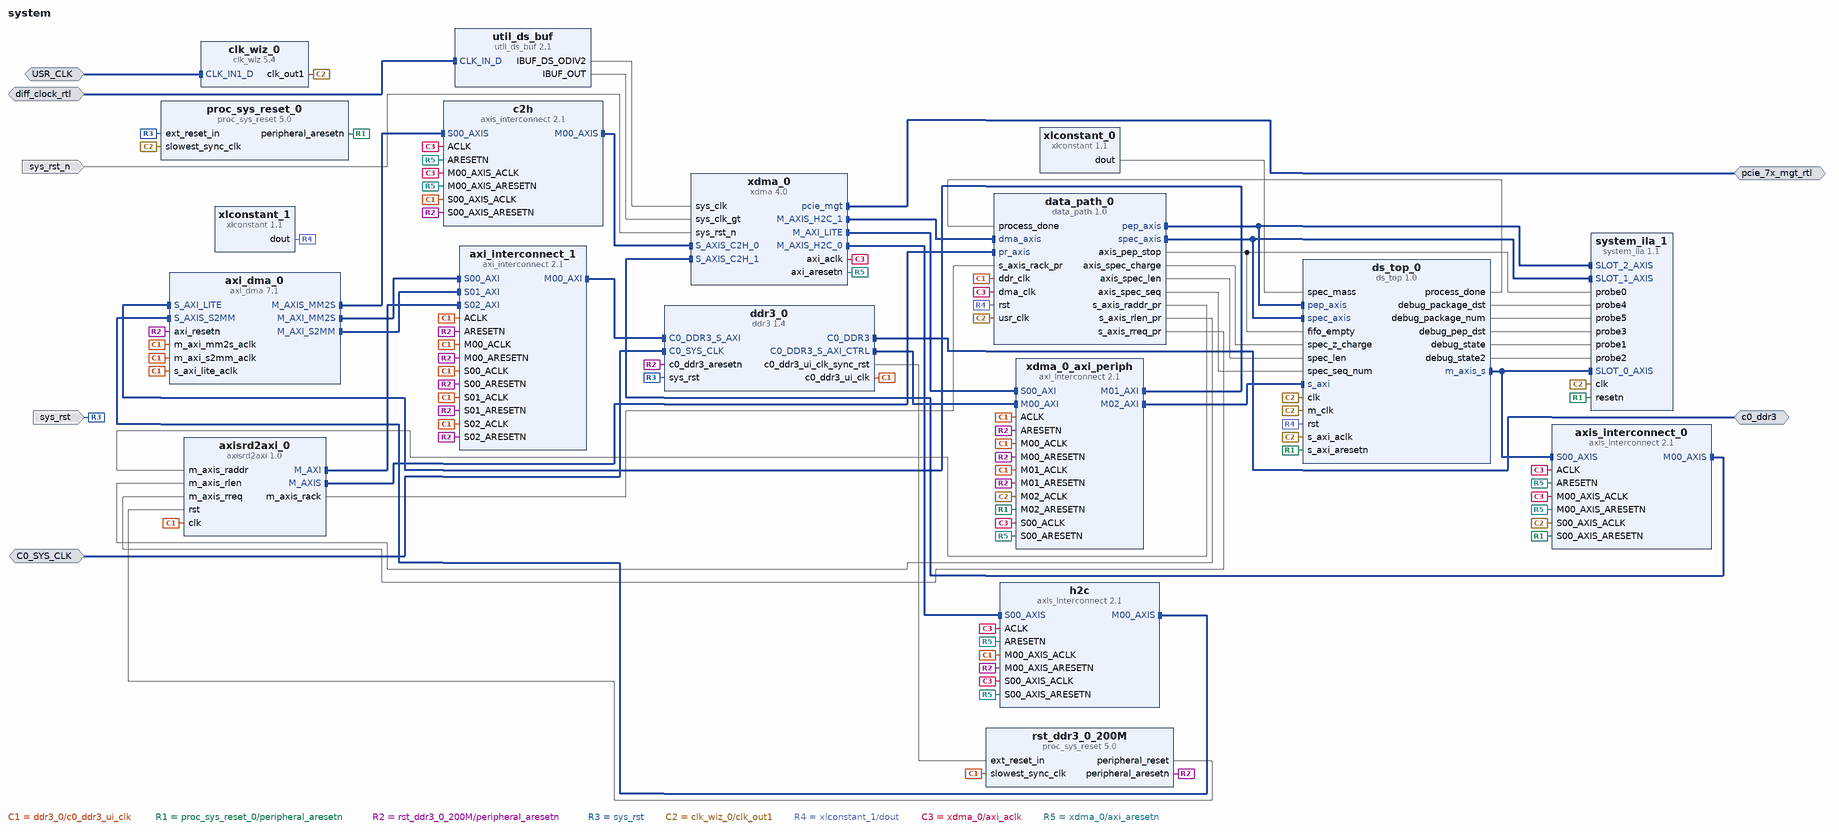
[diagram p0: block diagram of the top level]
# Vivado block design system, xcku115-flva1517-2-e, Vivado 2017.4
create_bd_design system

create_bd_intf_port -mode Slave -vlnv xilinx.com:interface:diff_clock_rtl:1.0 C0_SYS_CLK
set_property -dict {CONFIG.FREQ_HZ 400000000} [get_bd_intf_ports C0_SYS_CLK]
create_bd_intf_port -mode Slave -vlnv xilinx.com:interface:diff_clock_rtl:1.0 USR_CLK
create_bd_intf_port -mode Master -vlnv xilinx.com:interface:ddrx_rtl:1.0 c0_ddr3
create_bd_intf_port -mode Slave -vlnv xilinx.com:interface:diff_clock_rtl:1.0 diff_clock_rtl
set_property -dict {CONFIG.FREQ_HZ 100000000} [get_bd_intf_ports diff_clock_rtl]
create_bd_intf_port -mode Master -vlnv xilinx.com:interface:pcie_7x_mgt_rtl:1.0 pcie_7x_mgt_rtl
create_bd_port -dir I -type rst sys_rst
set_property -dict {CONFIG.POLARITY ACTIVE_HIGH} [get_bd_ports sys_rst]
create_bd_port -dir I -type rst sys_rst_n

create_bd_cell -type ip -vlnv xilinx.com:ip:axi_dma:7.1 axi_dma_0
set_property -dict {CONFIG.c_include_sg 0 CONFIG.c_sg_length_width 22} [get_bd_cells axi_dma_0]
create_bd_cell -type ip -vlnv xilinx.com:ip:axi_interconnect:2.1 axi_interconnect_1
set_property -dict {CONFIG.NUM_SI 3 CONFIG.NUM_MI 1 CONFIG.SYNCHRONIZATION_STAGES 2} [get_bd_cells axi_interconnect_1]
create_bd_cell -type ip -vlnv xilinx.com:ip:axis_interconnect:2.1 axis_interconnect_0
set_property -dict {CONFIG.NUM_MI 1} [get_bd_cells axis_interconnect_0]
create_bd_cell -type ip -vlnv xilinx.com:user:axisrd2axi:1.0 axisrd2axi_0
create_bd_cell -type ip -vlnv xilinx.com:ip:axis_interconnect:2.1 c2h
set_property -dict {CONFIG.NUM_MI 1} [get_bd_cells c2h]
create_bd_cell -type ip -vlnv xilinx.com:ip:clk_wiz:5.4 clk_wiz_0
set_property -dict [list \
  CONFIG.PRIMITIVE Auto \
  CONFIG.USE_FREQ_SYNTH false \
  CONFIG.USE_PHASE_ALIGNMENT false \
  CONFIG.SECONDARY_SOURCE Single_ended_clock_capable_pin \
  CONFIG.PRIM_SOURCE Differential_clock_capable_pin \
  CONFIG.CLKOUT1_DRIVES Buffer \
  CONFIG.CLKOUT2_DRIVES Buffer \
  CONFIG.CLKOUT3_DRIVES Buffer \
  CONFIG.CLKOUT4_DRIVES Buffer \
  CONFIG.CLKOUT5_DRIVES Buffer \
  CONFIG.CLKOUT6_DRIVES Buffer \
  CONFIG.CLKOUT7_DRIVES Buffer \
  CONFIG.FEEDBACK_SOURCE FDBK_AUTO \
  CONFIG.USE_LOCKED false \
  CONFIG.USE_RESET false \
  CONFIG.MMCM_DIVCLK_DIVIDE 1 \
  CONFIG.MMCM_CLKFBOUT_MULT_F 10.000 \
  CONFIG.MMCM_CLKIN1_PERIOD 10.000 \
  CONFIG.MMCM_CLKIN2_PERIOD 10.000 \
  CONFIG.MMCM_COMPENSATION AUTO \
  CONFIG.MMCM_CLKOUT0_DIVIDE_F 10.000 \
  CONFIG.AUTO_PRIMITIVE BUFGCE_DIV \
  CONFIG.CLKOUT1_JITTER 130.958 \
  CONFIG.CLKOUT1_PHASE_ERROR 98.575 \
] [get_bd_cells clk_wiz_0]
create_bd_cell -type ip -vlnv fudan:bio:data_path:1.0 data_path_0
create_bd_cell -type ip -vlnv xilinx.com:ip:ddr3:1.4 ddr3_0
set_property -dict [list \
  CONFIG.C0.DDR3_TimePeriod 1250 \
  CONFIG.C0.DDR3_InputClockPeriod 2500 \
  CONFIG.C0.DDR3_MemoryType SODIMMs \
  CONFIG.C0.DDR3_MemoryPart MT9KSF51272HZ-1G6 \
  CONFIG.C0.DDR3_DataWidth 72 \
  CONFIG.C0.DDR3_CasLatency 11 \
  CONFIG.C0.DDR3_CasWriteLatency 8 \
  CONFIG.C0.DDR3_AxiDataWidth 512 \
  CONFIG.C0.DDR3_AxiArbitrationScheme WRITE_PRIORITY_REG \
  CONFIG.C0.DDR3_AxiAddressWidth 32 \
  CONFIG.C0.DDR3_Mem_Add_Map BANK_ROW_COLUMN \
] [get_bd_cells ddr3_0]
create_bd_cell -type ip -vlnv fudan:bio:ds_top:1.0 ds_top_0
create_bd_cell -type ip -vlnv xilinx.com:ip:axis_interconnect:2.1 h2c
set_property -dict {CONFIG.NUM_MI 1} [get_bd_cells h2c]
create_bd_cell -type ip -vlnv xilinx.com:ip:proc_sys_reset:5.0 proc_sys_reset_0
create_bd_cell -type ip -vlnv xilinx.com:ip:proc_sys_reset:5.0 rst_ddr3_0_200M
create_bd_cell -type ip -vlnv xilinx.com:ip:system_ila:1.1 system_ila_1
set_property -dict [list \
  CONFIG.C_SLOT_1_TYPE 0 \
  CONFIG.C_SLOT_0_TYPE 0 \
  CONFIG.C_SLOT_0_APC_EN 0 \
  CONFIG.C_SLOT_1_APC_EN 0 \
  CONFIG.C_SLOT_2_APC_EN 0 \
  CONFIG.C_SLOT_0_AXI_DATA_SEL 1 \
  CONFIG.C_SLOT_1_AXI_DATA_SEL 1 \
  CONFIG.C_SLOT_2_AXI_DATA_SEL 1 \
  CONFIG.C_SLOT_0_AXI_TRIG_SEL 1 \
  CONFIG.C_SLOT_1_AXI_TRIG_SEL 1 \
  CONFIG.C_SLOT_2_AXI_TRIG_SEL 1 \
  CONFIG.C_PROBE6_TYPE 0 \
  CONFIG.C_PROBE5_TYPE 0 \
  CONFIG.C_PROBE4_TYPE 0 \
  CONFIG.C_PROBE3_TYPE 0 \
  CONFIG.C_PROBE2_TYPE 0 \
  CONFIG.C_PROBE1_TYPE 0 \
  CONFIG.C_PROBE0_TYPE 0 \
  CONFIG.C_PROBE6_WIDTH 1 \
  CONFIG.C_PROBE5_WIDTH 32 \
  CONFIG.C_PROBE4_WIDTH 2 \
  CONFIG.C_PROBE3_WIDTH 2 \
  CONFIG.C_PROBE2_WIDTH 4 \
  CONFIG.C_PROBE1_WIDTH 4 \
  CONFIG.C_NUM_OF_PROBES 6 \
  CONFIG.C_PROBE2_MU_CNT 1 \
  CONFIG.C_PROBE1_MU_CNT 1 \
  CONFIG.ALL_PROBE_SAME_MU false \
  CONFIG.C_NUM_MONITOR_SLOTS 3 \
  CONFIG.C_SLOT_0_INTF_TYPE xilinx.com:interface:axis_rtl:1.0 \
  CONFIG.C_SLOT_1_INTF_TYPE xilinx.com:interface:axis_rtl:1.0 \
  CONFIG.C_SLOT_2_INTF_TYPE xilinx.com:interface:axis_rtl:1.0 \
  CONFIG.C_MON_TYPE MIX \
  CONFIG.C_PROBE_WIDTH_PROPAGATION MANUAL \
] [get_bd_cells system_ila_1]
create_bd_cell -type ip -vlnv xilinx.com:ip:util_ds_buf:2.1 util_ds_buf
set_property -dict {CONFIG.C_BUF_TYPE IBUFDSGTE} [get_bd_cells util_ds_buf]
create_bd_cell -type ip -vlnv xilinx.com:ip:xdma:4.0 xdma_0
set_property -dict [list \
  CONFIG.pl_link_cap_max_link_width X8 \
  CONFIG.pl_link_cap_max_link_speed 8.0_GT/s \
  CONFIG.axi_data_width 256_bit \
  CONFIG.axisten_freq 250 \
  CONFIG.en_ext_ch_gt_drp false \
  CONFIG.pf0_device_id 8038 \
  CONFIG.pf0_base_class_menu Memory_controller \
  CONFIG.pf0_class_code_base 05 \
  CONFIG.pf0_sub_class_interface_menu Other_memory_controller \
  CONFIG.pf0_class_code_sub 80 \
  CONFIG.pf0_class_code_interface 00 \
  CONFIG.axilite_master_en true \
  CONFIG.axilite_master_size 1 \
  CONFIG.axilite_master_scale Megabytes \
  CONFIG.axist_bypass_en false \
  CONFIG.pciebar2axibar_axil_master 0x0000000043600000 \
  CONFIG.xdma_rnum_chnl 2 \
  CONFIG.xdma_wnum_chnl 2 \
  CONFIG.plltype QPLL1 \
  CONFIG.xdma_axi_intf_mm AXI_Stream \
  CONFIG.cfg_mgmt_if false \
  CONFIG.axil_master_64bit_en false \
] [get_bd_cells xdma_0]
create_bd_cell -type ip -vlnv xilinx.com:ip:axi_interconnect:2.1 xdma_0_axi_periph
set_property -dict {CONFIG.NUM_SI 1 CONFIG.NUM_MI 3} [get_bd_cells xdma_0_axi_periph]
create_bd_cell -type ip -vlnv xilinx.com:ip:xlconstant:1.1 xlconstant_0
set_property -dict {CONFIG.CONST_WIDTH 40 CONFIG.CONST_VAL 0} [get_bd_cells xlconstant_0]
create_bd_cell -type ip -vlnv xilinx.com:ip:xlconstant:1.1 xlconstant_1
set_property -dict {CONFIG.CONST_VAL 0} [get_bd_cells xlconstant_1]

# ---- connections ----

connect_bd_intf_net [get_bd_intf_pins axi_dma_0/M_AXIS_MM2S] [get_bd_intf_pins c2h/S00_AXIS]
connect_bd_intf_net [get_bd_intf_pins axi_dma_0/M_AXI_MM2S] [get_bd_intf_pins axi_interconnect_1/S00_AXI]
connect_bd_intf_net [get_bd_intf_pins axi_dma_0/M_AXI_S2MM] [get_bd_intf_pins axi_interconnect_1/S01_AXI]
connect_bd_intf_net [get_bd_intf_pins axi_interconnect_1/M00_AXI] [get_bd_intf_pins ddr3_0/C0_DDR3_S_AXI]
connect_bd_intf_net [get_bd_intf_pins axis_interconnect_0/M00_AXIS] [get_bd_intf_pins xdma_0/S_AXIS_C2H_1]
connect_bd_intf_net [get_bd_intf_pins axi_interconnect_1/S02_AXI] [get_bd_intf_pins axisrd2axi_0/M_AXI]
connect_bd_intf_net [get_bd_intf_pins axisrd2axi_0/M_AXIS] [get_bd_intf_pins data_path_0/pr_axis]
connect_bd_intf_net [get_bd_intf_pins c2h/M00_AXIS] [get_bd_intf_pins xdma_0/S_AXIS_C2H_0]
connect_bd_intf_net [get_bd_intf_pins data_path_0/pep_axis] [get_bd_intf_pins ds_top_0/pep_axis]
connect_bd_intf_net [get_bd_intf_pins data_path_0/pep_axis] [get_bd_intf_pins system_ila_1/SLOT_2_AXIS]
connect_bd_intf_net [get_bd_intf_pins data_path_0/spec_axis] [get_bd_intf_pins ds_top_0/spec_axis]
connect_bd_intf_net [get_bd_intf_pins data_path_0/spec_axis] [get_bd_intf_pins system_ila_1/SLOT_1_AXIS]
connect_bd_intf_net [get_bd_intf_pins axis_interconnect_0/S00_AXIS] [get_bd_intf_pins ds_top_0/m_axis_s]
connect_bd_intf_net [get_bd_intf_pins axis_interconnect_0/S00_AXIS] [get_bd_intf_pins system_ila_1/SLOT_0_AXIS]
connect_bd_intf_net [get_bd_intf_pins axi_dma_0/S_AXIS_S2MM] [get_bd_intf_pins h2c/M00_AXIS]
connect_bd_intf_net [get_bd_intf_pins h2c/S00_AXIS] [get_bd_intf_pins xdma_0/M_AXIS_H2C_0]
connect_bd_intf_net [get_bd_intf_pins data_path_0/dma_axis] [get_bd_intf_pins xdma_0/M_AXIS_H2C_1]
connect_bd_intf_net [get_bd_intf_pins xdma_0/M_AXI_LITE] [get_bd_intf_pins xdma_0_axi_periph/S00_AXI]
connect_bd_intf_net [get_bd_intf_pins ddr3_0/C0_DDR3_S_AXI_CTRL] [get_bd_intf_pins xdma_0_axi_periph/M00_AXI]
connect_bd_intf_net [get_bd_intf_pins axi_dma_0/S_AXI_LITE] [get_bd_intf_pins xdma_0_axi_periph/M01_AXI]
connect_bd_intf_net [get_bd_intf_pins ds_top_0/s_axi] [get_bd_intf_pins xdma_0_axi_periph/M02_AXI]
connect_bd_intf_net [get_bd_intf_ports C0_SYS_CLK] [get_bd_intf_pins ddr3_0/C0_SYS_CLK]
connect_bd_intf_net [get_bd_intf_ports USR_CLK] [get_bd_intf_pins clk_wiz_0/CLK_IN1_D]
connect_bd_intf_net [get_bd_intf_ports c0_ddr3] [get_bd_intf_pins ddr3_0/C0_DDR3]
connect_bd_intf_net [get_bd_intf_ports diff_clock_rtl] [get_bd_intf_pins util_ds_buf/CLK_IN_D]
connect_bd_intf_net [get_bd_intf_ports pcie_7x_mgt_rtl] [get_bd_intf_pins xdma_0/pcie_mgt]
connect_bd_net [get_bd_pins axisrd2axi_0/m_axis_rack] [get_bd_pins data_path_0/s_axis_rack_pr]
connect_bd_net [get_bd_pins data_path_0/axis_pep_stop] [get_bd_pins ds_top_0/fifo_empty] [get_bd_pins system_ila_1/probe0]
connect_bd_net [get_bd_pins data_path_0/axis_spec_charge] [get_bd_pins ds_top_0/spec_z_charge]
connect_bd_net [get_bd_pins data_path_0/axis_spec_len] [get_bd_pins ds_top_0/spec_len]
connect_bd_net [get_bd_pins data_path_0/axis_spec_seq] [get_bd_pins ds_top_0/spec_seq_num]
connect_bd_net [get_bd_pins data_path_0/s_axis_raddr_pr] [get_bd_pins axisrd2axi_0/m_axis_raddr]
connect_bd_net [get_bd_pins data_path_0/s_axis_rlen_pr] [get_bd_pins axisrd2axi_0/m_axis_rlen]
connect_bd_net [get_bd_pins data_path_0/s_axis_rreq_pr] [get_bd_pins axisrd2axi_0/m_axis_rreq]
connect_bd_net [get_bd_pins ddr3_0/c0_ddr3_ui_clk] \
  [get_bd_pins axi_dma_0/m_axi_mm2s_aclk] [get_bd_pins axi_dma_0/m_axi_s2mm_aclk] [get_bd_pins axi_dma_0/s_axi_lite_aclk] \
  [get_bd_pins axisrd2axi_0/clk] [get_bd_pins data_path_0/ddr_clk] [get_bd_pins rst_ddr3_0_200M/slowest_sync_clk] \
  [get_bd_pins axi_interconnect_1/ACLK] [get_bd_pins axi_interconnect_1/M00_ACLK] [get_bd_pins axi_interconnect_1/S00_ACLK] \
  [get_bd_pins axi_interconnect_1/S01_ACLK] [get_bd_pins axi_interconnect_1/S02_ACLK] [get_bd_pins c2h/S00_AXIS_ACLK] \
  [get_bd_pins h2c/M00_AXIS_ACLK] [get_bd_pins xdma_0_axi_periph/ACLK] [get_bd_pins xdma_0_axi_periph/M00_ACLK] \
  [get_bd_pins xdma_0_axi_periph/M01_ACLK]
connect_bd_net [get_bd_pins ddr3_0/c0_ddr3_ui_clk_sync_rst] [get_bd_pins rst_ddr3_0_200M/ext_reset_in]
connect_bd_net -net debug_package_dst [get_bd_pins ds_top_0/debug_package_dst] [get_bd_pins system_ila_1/probe4]
connect_bd_net -net debug_package_num [get_bd_pins ds_top_0/debug_package_num] [get_bd_pins system_ila_1/probe5]
connect_bd_net -net debug_pep_dst [get_bd_pins ds_top_0/debug_pep_dst] [get_bd_pins system_ila_1/probe3]
connect_bd_net [get_bd_pins ds_top_0/debug_state] [get_bd_pins system_ila_1/probe1]
connect_bd_net [get_bd_pins ds_top_0/debug_state2] [get_bd_pins system_ila_1/probe2]
connect_bd_net [get_bd_pins ds_top_0/process_done] [get_bd_pins data_path_0/process_done]
connect_bd_net [get_bd_pins proc_sys_reset_0/peripheral_aresetn] \
  [get_bd_pins ds_top_0/s_axi_aresetn] [get_bd_pins system_ila_1/resetn] [get_bd_pins axis_interconnect_0/S00_AXIS_ARESETN] \
  [get_bd_pins xdma_0_axi_periph/M02_ARESETN]
connect_bd_net [get_bd_pins rst_ddr3_0_200M/peripheral_aresetn] \
  [get_bd_pins axi_dma_0/axi_resetn] [get_bd_pins ddr3_0/c0_ddr3_aresetn] [get_bd_pins axi_interconnect_1/ARESETN] \
  [get_bd_pins axi_interconnect_1/M00_ARESETN] [get_bd_pins axi_interconnect_1/S00_ARESETN] \
  [get_bd_pins axi_interconnect_1/S01_ARESETN] [get_bd_pins axi_interconnect_1/S02_ARESETN] \
  [get_bd_pins c2h/S00_AXIS_ARESETN] [get_bd_pins h2c/M00_AXIS_ARESETN] [get_bd_pins xdma_0_axi_periph/ARESETN] \
  [get_bd_pins xdma_0_axi_periph/M00_ARESETN] [get_bd_pins xdma_0_axi_periph/M01_ARESETN]
connect_bd_net [get_bd_pins rst_ddr3_0_200M/peripheral_reset] [get_bd_pins axisrd2axi_0/rst]
connect_bd_net [get_bd_ports sys_rst] [get_bd_pins ddr3_0/sys_rst] [get_bd_pins proc_sys_reset_0/ext_reset_in]
connect_bd_net [get_bd_ports sys_rst_n] [get_bd_pins xdma_0/sys_rst_n]
connect_bd_net -net usr_clk_1 [get_bd_pins clk_wiz_0/clk_out1] \
  [get_bd_pins data_path_0/usr_clk] [get_bd_pins ds_top_0/clk] [get_bd_pins ds_top_0/m_clk] [get_bd_pins ds_top_0/s_axi_aclk] \
  [get_bd_pins proc_sys_reset_0/slowest_sync_clk] [get_bd_pins system_ila_1/clk] \
  [get_bd_pins axis_interconnect_0/S00_AXIS_ACLK] [get_bd_pins xdma_0_axi_periph/M02_ACLK]
connect_bd_net [get_bd_pins util_ds_buf/IBUF_DS_ODIV2] [get_bd_pins xdma_0/sys_clk]
connect_bd_net [get_bd_pins util_ds_buf/IBUF_OUT] [get_bd_pins xdma_0/sys_clk_gt]
connect_bd_net -net vio_0_probe_out0 [get_bd_pins xlconstant_1/dout] [get_bd_pins data_path_0/rst] [get_bd_pins ds_top_0/rst]
connect_bd_net [get_bd_pins xdma_0/axi_aclk] \
  [get_bd_pins data_path_0/dma_clk] [get_bd_pins axis_interconnect_0/ACLK] [get_bd_pins axis_interconnect_0/M00_AXIS_ACLK] \
  [get_bd_pins c2h/ACLK] [get_bd_pins c2h/M00_AXIS_ACLK] [get_bd_pins h2c/ACLK] [get_bd_pins h2c/S00_AXIS_ACLK] \
  [get_bd_pins xdma_0_axi_periph/S00_ACLK]
connect_bd_net [get_bd_pins xdma_0/axi_aresetn] \
  [get_bd_pins axis_interconnect_0/ARESETN] [get_bd_pins axis_interconnect_0/M00_AXIS_ARESETN] [get_bd_pins c2h/ARESETN] \
  [get_bd_pins c2h/M00_AXIS_ARESETN] [get_bd_pins h2c/ARESETN] [get_bd_pins h2c/S00_AXIS_ARESETN] \
  [get_bd_pins xdma_0_axi_periph/S00_ARESETN]
connect_bd_net [get_bd_pins xlconstant_0/dout] [get_bd_pins ds_top_0/spec_mass]

# ---- address map ----
assign_bd_address -offset 0x00000000 -range 4G -target_address_space [get_bd_addr_spaces axi_dma_0/Data_MM2S] [get_bd_addr_segs ddr3_0/C0_DDR3_MEMORY_MAP/C0_DDR3_ADDRESS_BLOCK]
assign_bd_address -offset 0x00000000 -range 4G -target_address_space [get_bd_addr_spaces axi_dma_0/Data_S2MM] [get_bd_addr_segs ddr3_0/C0_DDR3_MEMORY_MAP/C0_DDR3_ADDRESS_BLOCK]
assign_bd_address -offset 0x00000000 -range 4G -target_address_space [get_bd_addr_spaces axisrd2axi_0/s_axi] [get_bd_addr_segs ddr3_0/C0_DDR3_MEMORY_MAP/C0_DDR3_ADDRESS_BLOCK]
assign_bd_address -offset 0x43600000 -range 4K -target_address_space [get_bd_addr_spaces xdma_0/M_AXI_LITE] [get_bd_addr_segs ds_top_0/s_axi/reg0]
assign_bd_address -offset 0x43602000 -range 4K -target_address_space [get_bd_addr_spaces xdma_0/M_AXI_LITE] [get_bd_addr_segs axi_dma_0/S_AXI_LITE/Reg]
assign_bd_address -offset 0x50000000 -range 4K -target_address_space [get_bd_addr_spaces xdma_0/M_AXI_LITE] [get_bd_addr_segs ddr3_0/C0_DDR3_MEMORY_MAP_CTRL/C0_REG]

validate_bd_design
save_bd_design
